# EAGLE design uPy_AudioCodec_00 (EAGLE 6.5.0)
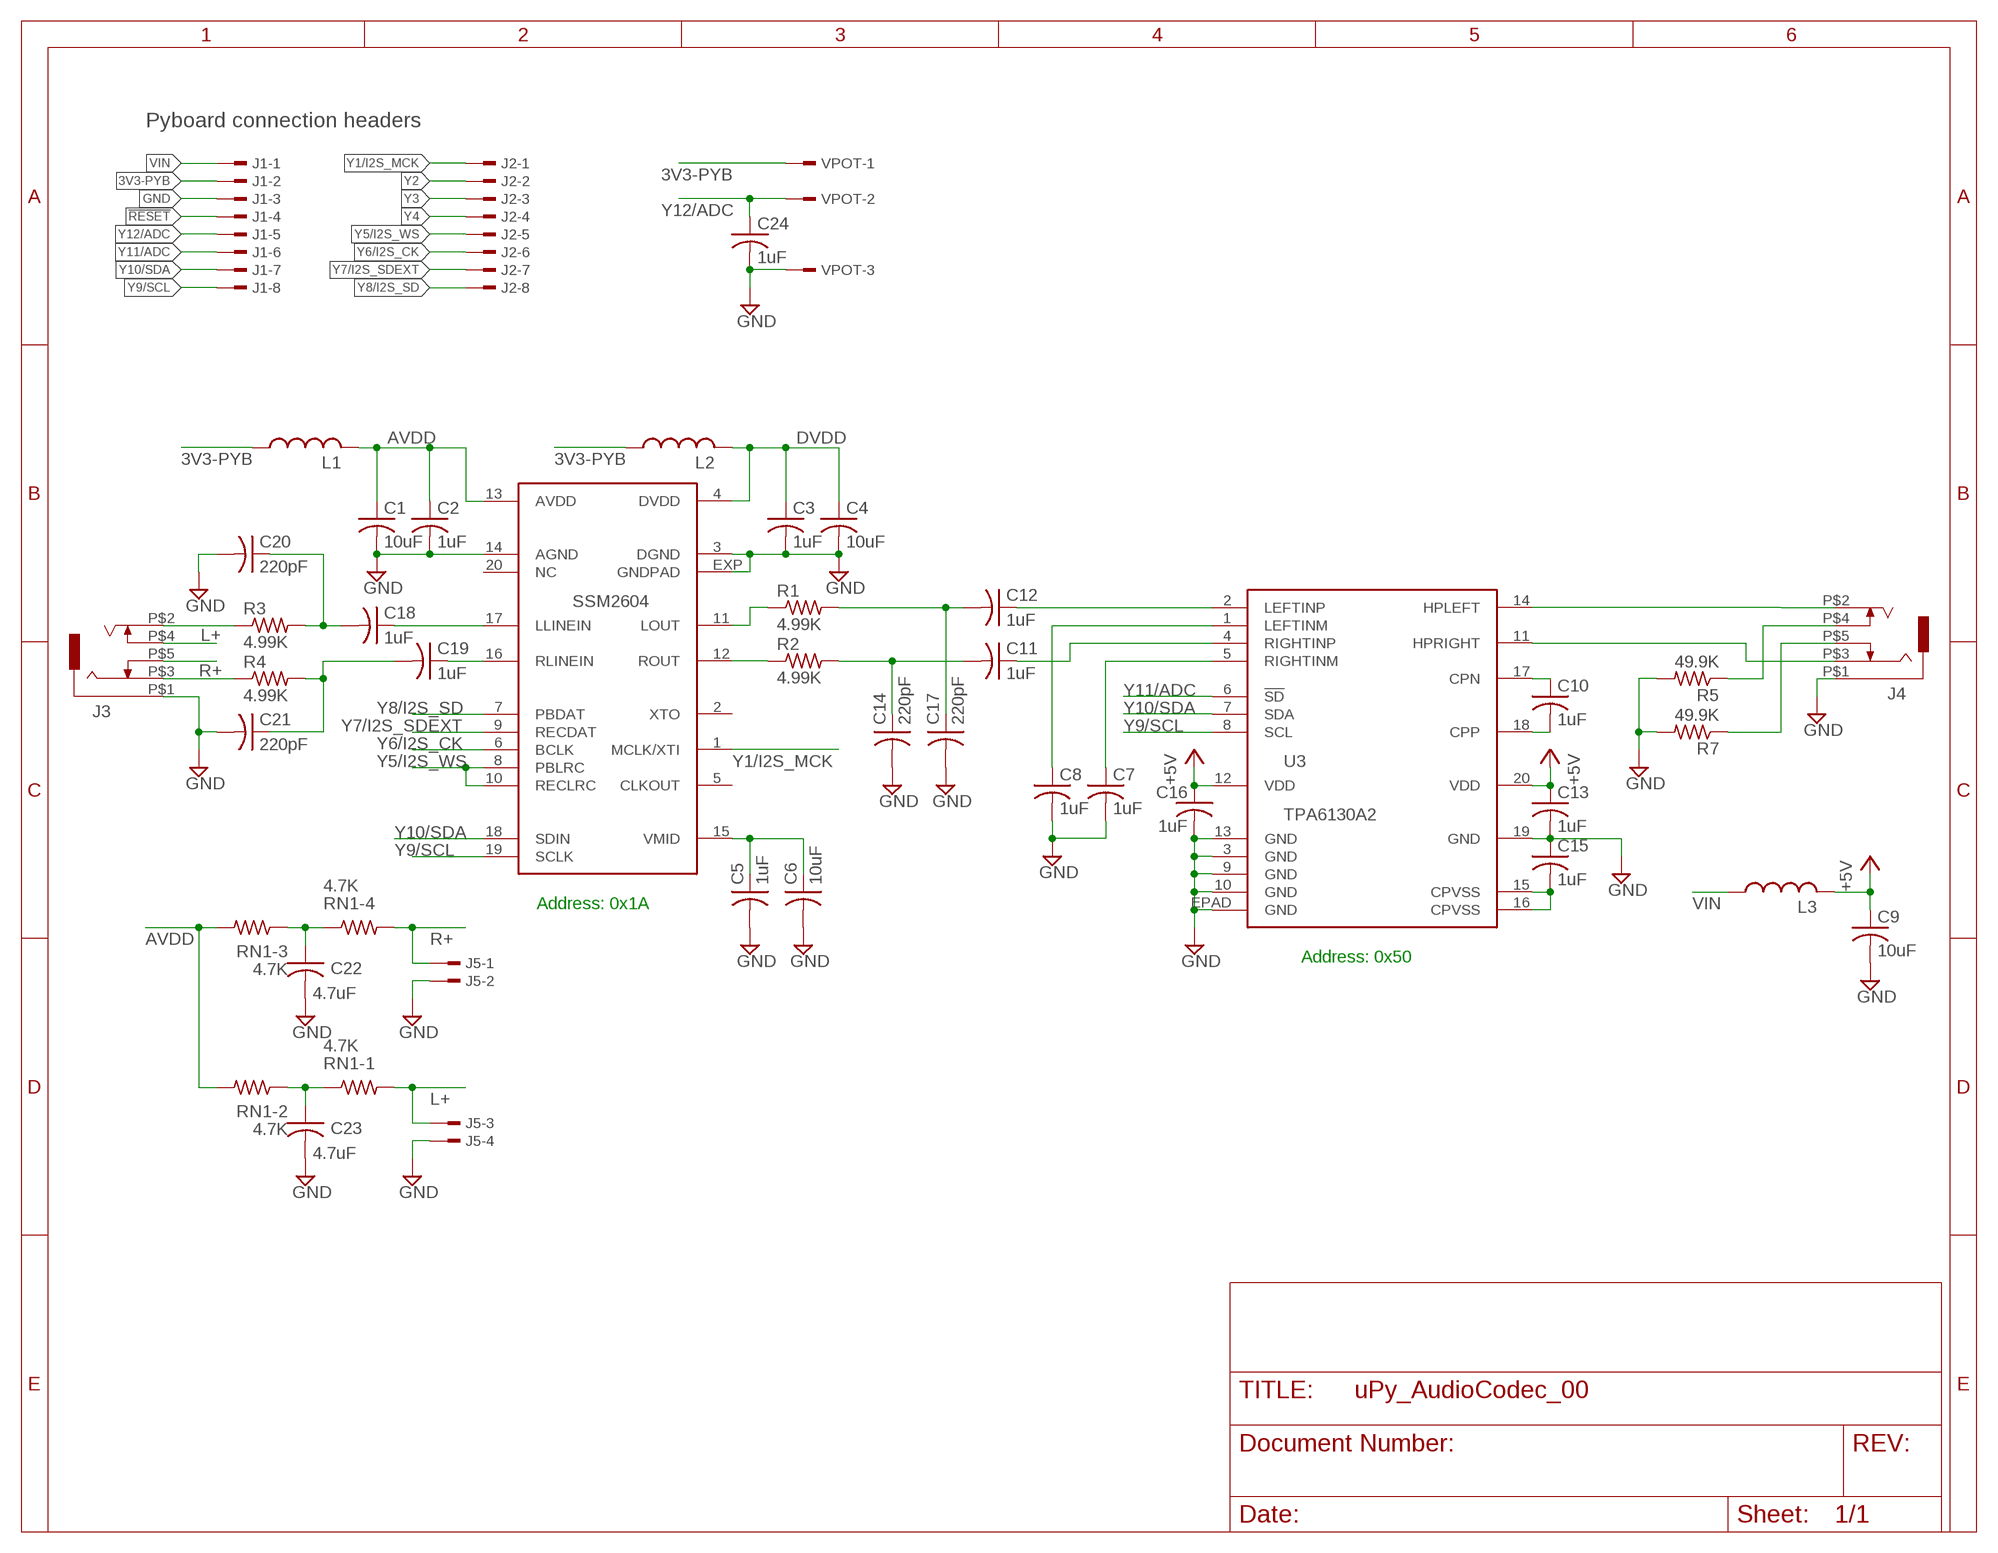
[diagram p0: schematic, sheet 1]

## Parts
C1  10uF  C-USC0603K  [C0603K]
C2  1uF  C-USC0805K  [C0805K]
C3  1uF  C-USC0603K  [C0603K]
C4  10uF  C-USC0805K  [C0805K]
C5  1uF  C-USC0603K  [C0603K]
C6  10uF  C-USC0805K  [C0805K]
C7  1uF  C-USC0603K  [C0603K]
C8  1uF  C-USC0603K  [C0603K]
C9  10uF  C-USC0805K  [C0805K]
C10  1uF  C-USC0603K  [C0603K]
C11  1uF  C-USC0603K  [C0603K]
C12  1uF  C-USC0603K  [C0603K]
C13  1uF  C-USC0603K  [C0603K]
C14  220pF  C-USC0603K  [C0603K]
C15  1uF  C-USC0603K  [C0603K]
C16  1uF  C-USC0603K  [C0603K]
C17  220pF  C-USC0603K  [C0603K]
C18  1uF  C-USC0603K  [C0603K]
C19  1uF  C-USC0603K  [C0603K]
C20  220pF  C-USC0603K  [C0603K]
C21  220pF  C-USC0603K  [C0603K]
C22  4.7uF  C-USC0603K  [C0603K]
C23  4.7uF  C-USC0603K  [C0603K]
C24  1uF  C-USC0603K  [C0603K]
J1  TSW-108-02-S-S-MOD  [TSW-108-02-S-S-MOD]
J2  TSW-108-02-S-S-MOD  [TSW-108-02-S-S-MOD]
J3  CON-JACK-STEREO  [CON-JACK-SJ1-3515-SMT]
J4  CON-JACK-STEREO  [CON-JACK-SJ1-3515-SMT]
J5  TSW-104-02-S-S  [TSW-104-02-S-S-MOD]
L1  L-USL3216C  [L3216C]
L2  L-USL3216C  [L3216C]
L3  L-USL3216C  [L3216C]
R1  4.99K  R-US_R0805  [R0805]
R2  4.99K  R-US_R0805  [R0805]
R3  4.99K  R-US_R0805  [R0805]
R4  4.99K  R-US_R0805  [R0805]
R5  49.9K  R-US_R0805  [R0805]
R7  49.9K  R-US_R0805  [R0805]
RN1  4.7K  4R-ISONET-BB  [CTS-742C083+]
U1  SSM2604-1  [LFCSP20-1]
U3  TPA6130A2  [QFN20-EP]
VPOT  TSW-103-02-S-S  [TSW-103-02-S-S-MOD]

## Nets
3V3-PYB: J1.2 L1.1 L2.1 VPOT.1
!RESET: J1.4
+5V: C9.1 C13.1 C16.1 L3.2 U3.12(VDD) U3.20(VDD)
AVDD: C1.1 C2.1 L1.2 RN1.P$6 RN1.P$7 U1.13(AVDD)
DVDD: C3.1 C4.1 L2.2 U1.4(DVDD)
GND: C1.2 C2.2 C3.2 C4.2 C5.2 C6.2 C7.2 C8.2 C9.2 C13.2 C14.2 C15.1 C16.2 C17.2 C20.2 C21.2 C22.2 C23.2 C24.2 J1.3 J3.P$1(SLEEVE) J4.P$1(SLEEVE) J5.2 J5.4 R5.2 R7.2 U1.3(DGND) U1.14(AGND) U1.EXP(GNDPAD) U3.3(GND) U3.9(GND) U3.10(GND) U3.13(GND) U3.19(GND) U3.EPAD(GND) VPOT.3
L+: J3.P$4(TIP_SW) J5.3 RN1.P$8
N$1: C12.1 U3.2(LEFTINP)
N$2: C18.1 U1.17(LLINEIN)
N$3: C19.1 U1.16(RLINEIN)
N$4: C11.1 U3.4(RIGHTINP)
N$5: J4.P$2(TIP) U3.14(HPLEFT)
N$6: C5.1 C6.1 U1.15(VMID)
N$7: C7.1 U3.5(RIGHTINM)
N$8: C8.1 U3.1(LEFTINM)
N$9: R1.1 U1.11(LOUT)
N$10: C15.2 U3.15(CPVSS) U3.16(CPVSS)
N$11: C10.2 U3.18(CPP)
N$12: J4.P$3(RING) U3.11(HPRIGHT)
N$13: C10.1 U3.17(CPN)
N$14: R2.1 U1.12(ROUT)
N$15: C11.2 C14.1 R2.2
N$16: J4.P$5(RING_SW) R7.1
N$17: J4.P$4(TIP_SW) R5.1
N$18: C12.2 C17.1 R1.2
N$19: J3.P$3(RING) R4.1
N$20: J3.P$2(TIP) R3.1
N$21: C18.2 C20.1 R3.2
N$22: C19.2 C21.1 R4.2
N$23: C22.1 RN1.P$3 RN1.P$4
N$24: C23.1 RN1.P$1 RN1.P$2
R+: J3.P$5(RING_SW) J5.1 RN1.P$5
VIN: J1.1 L3.1
Y1/I2S_MCK: J2.1 U1.1(MCLK/XTI)
Y2: J2.2
Y3: J2.3
Y4: J2.4
Y5/I2S_WS: J2.5 U1.8(PBLRC) U1.10(RECLRC)
Y6/I2S_CK: J2.6 U1.6(BCLK)
Y7/I2S_SDEXT: J2.7 U1.9(RECDAT)
Y8/I2S_SD: J2.8 U1.7(PBDAT)
Y9/SCL: J1.8 U1.19(SCLK) U3.8(SCL)
Y10/SDA: J1.7 U1.18(SDIN) U3.7(SDA)
Y11/ADC: J1.6 U3.6(!SD)
Y12/ADC: C24.1 J1.5 VPOT.2
Unconnected: U1.2(XTO) U1.5(CLKOUT) U1.20(NC)

## Notes on the sheet
- Pyboard connection headers
- SSM2604
- Address: 0x1A
- Address: 0x50

## Library data of the parts
C1-C24 = rcl:C-US: CAPACITOR, American symbol
J1 J2 = pyIMU-03:TSW-108-02-S-S: THROUGH-HOLE .025" SQ POST HEADER Source: Samtec TSW.pdf
J3 J4 = custom:CON-JACK-STEREO
J5 = uPy_AudioCodec_00:TSW-104-02-S-S
L1-L3 = rcl:L-US: INDUCTOR, American symbol
R1-R5 R7 = rcl:R-US_: RESISTOR, American symbol
RN1 = custom:4R-ISONET-B
U1 = custom:SSM2604
U3 = custom:TPA6130A2
VPOT = uPy_AudioCodec_00:TSW-103-02-S-S

## Net classes
0 default: clearance 0.205 mm

## Board
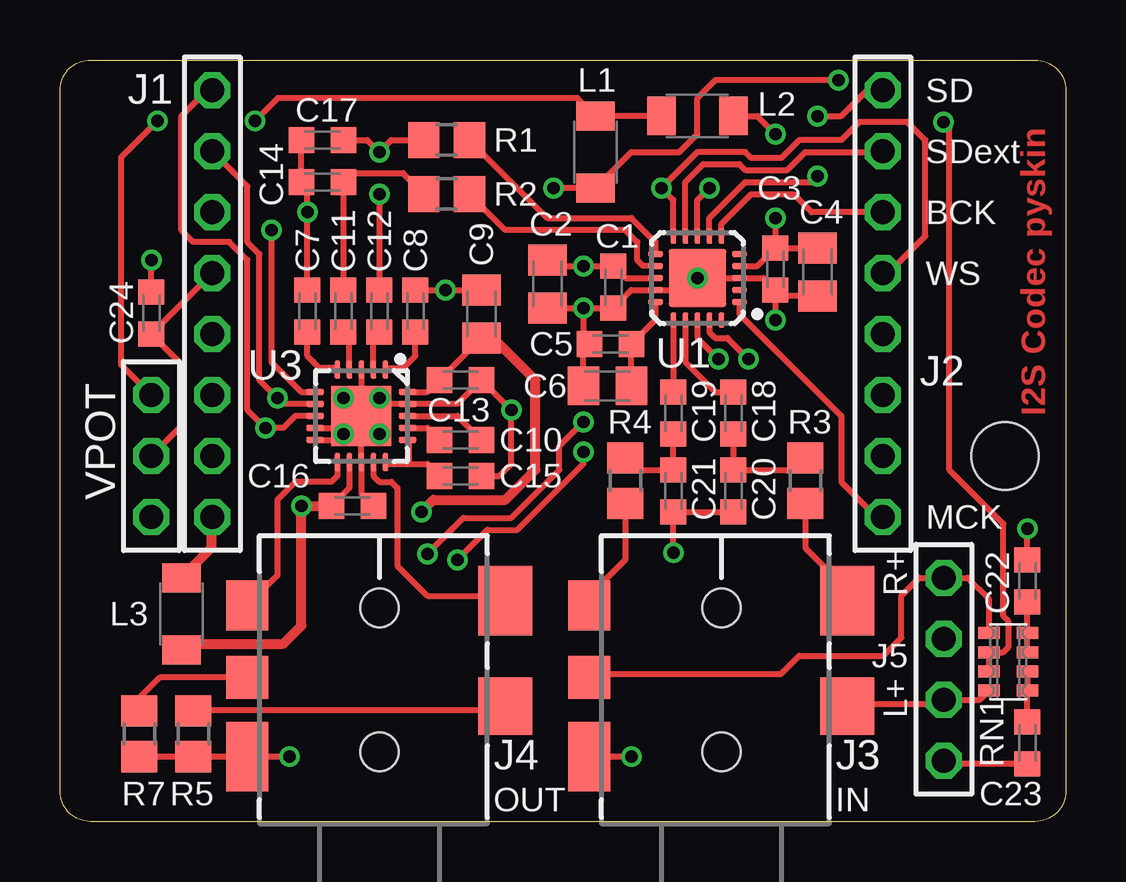
[diagram p1: board, top side]
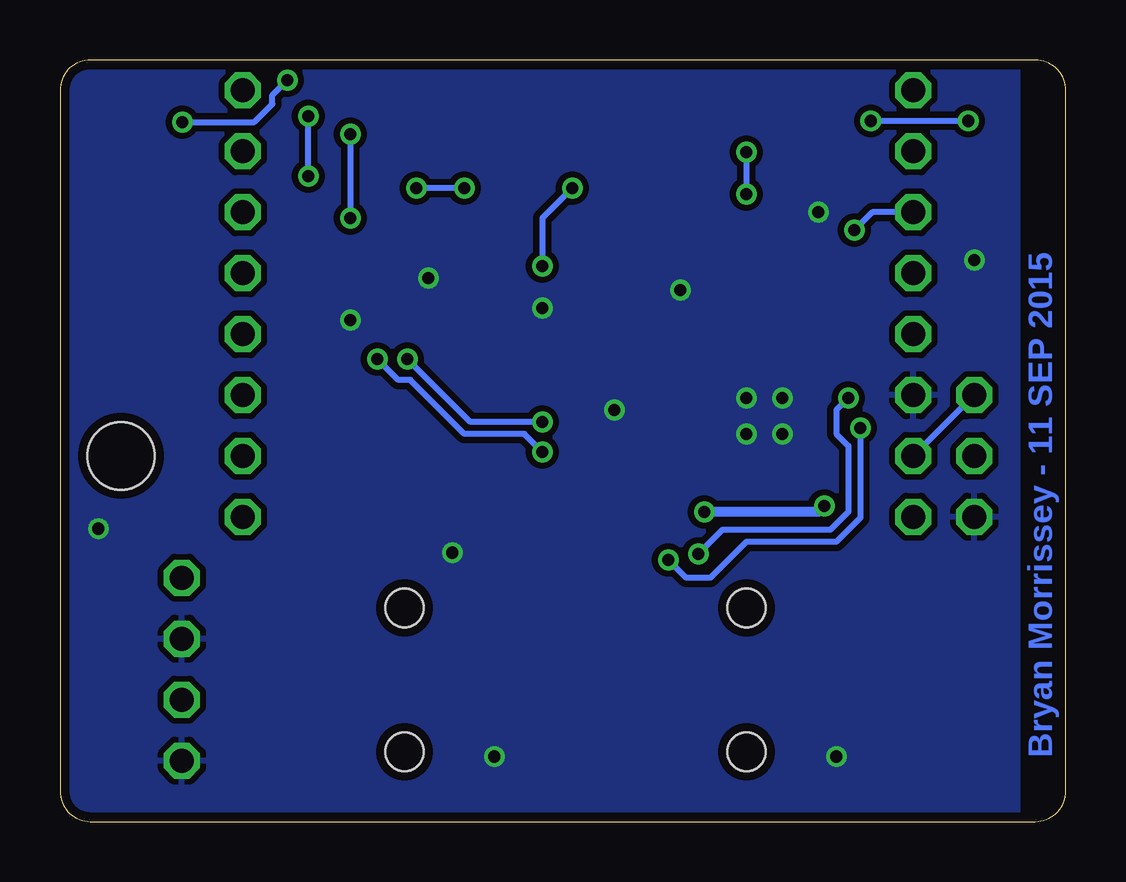
[diagram p2: board, bottom side, seen from below]

Size 41.91 x 31.75 mm. Coordinates in mm from the lower left corner, seen from the top.
Outline: 1.27,31.75 40.64,31.75 arc-90 41.91,30.48 41.91,1.27 arc-90 40.64,0 1.27,0 arc-90 0,1.27 0,30.48 arc-90 1.27,31.75
Copper layers (1*16): Top 0.0356mm / dielectric 1.5011mm / Bottom 0.0356mm
Design rules "LaenPCBOrder *": minimum track width 6mil, minimum drill 13mil, track to track 6mil, track to pad 6mil, pad to pad 6mil, via to via 6mil, smd to smd 6mil, copper to edge 15mil, drill to drill 6mil, minimum pad ring 7mil, minimum via ring 7mil, stop-mask expansion 3mil, vias tented up to drill 0mil, thermal gap 10mil
Holes 2.8 mm at 39.37,15.24

### Footprints (pad centres in the part's own frame; a part is rotated, then mirrored left to right if it is on the bottom)
C0603K = smd 1.05 x 1.08: 1 -0.875,0; 2 0.875,0
C0805K = smd 1.3 x 1.6: 1 -1,0; 2 1,0
TSW-108-02-S-S-MOD = drill 1 pad 1.5 octagon: 1 8.89,0; 2 6.35,0; 3 3.81,0; 4 1.27,0; 5 -1.27,0; 6 -3.81,0; 7 -6.35,0; 8 -8.89,0
CON-JACK-SJ1-3515-SMT = smd 2.9 x 1.75: P$1 -0.2,5.5 | smd 2.9 x 2.25: P$2 6.3,-5.25 | smd 2.1 x 1.75: P$3 6.1,5.5 | smd 2.4 x 2.25: P$4 1.9,-5.25 | smd 1.8 x 1.75: P$5 3.1,5.5 | hole 1.6: 0,0; 6,0
TSW-104-02-S-S-MOD = drill 1 pad 1.5 octagon: 1 3.81,0; 2 1.27,0; 3 -1.27,0; 4 -3.81,0
L3216C = smd 1.2 x 1.6: 1 -1.5,0; 2 1.5,0
R0805 = smd 1.3 x 1.5: 1 -0.95,0; 2 0.95,0
CTS-742C083+ = smd 0.9 x 0.5: P$1 -0.8,1.2; P$2 -0.8,0.4; P$3 -0.8,-0.4; P$4 -0.8,-1.2; P$5 0.8,-1.2; P$6 0.8,-0.4; P$7 0.8,0.4; P$8 0.8,1.2
LFCSP20-1 = smd 0.635 x 0.254: 1 -1.75,1; 2 -1.75,0.5; 3 -1.75,0; 4 -1.75,-0.5; 5 -1.75,-1; 11 1.75,-1; 12 1.75,-0.5; 13 1.75,0; 14 1.75,0.5; 15 1.75,1 | smd 0.254 x 0.635: 6 -1,-1.75; 7 -0.5,-1.75; 8 0,-1.75; 9 0.5,-1.75; 10 1,-1.75; 16 1,1.75; 17 0.5,1.75; 18 0,1.75; 19 -0.5,1.75; 20 -1,1.75 | smd 2.4 x 2.4: EXP 0,0
QFN20-EP = smd 0.75 x 0.25: 1 -1.925,1; 2 -1.925,0.5; 3 -1.925,0; 4 -1.925,-0.5; 5 -1.925,-1; 11 1.925,-1; 12 1.925,-0.5; 13 1.925,0; 14 1.925,0.5; 15 1.925,1 | smd 0.25 x 0.75: 6 -1,-1.925; 7 -0.5,-1.925; 8 0,-1.925; 9 0.5,-1.925; 10 1,-1.925; 16 1,1.925; 17 0.5,1.925; 18 0,1.925; 19 -0.5,1.925; 20 -1,1.925 | smd 2.5 x 2.5: EPAD 0,0
TSW-103-02-S-S-MOD = drill 1 pad 1.5 octagon: 1 2.54,0; 2 0,0; 3 -2.54,0

### Placement (x,y rotation side)
C1  23.06,22.29 270 top
C2  20.31,22.41 270 top
C3  29.81,23.04 270 top
C4  31.56,22.91 270 top
C5  22.93,19.91 180 top
C6  22.81,18.16 180 top
C7  10.31,21.29 90 top
C8  14.81,21.29 90 top
C9  17.56,21.16 90 top
C10  16.68,15.91 0 top
C11  11.81,21.29 90 top
C12  13.31,21.29 90 top
C13  16.68,18.41 0 top
C14  10.94,26.66 180 top
C15  16.68,14.41 180 top
C16  12.19,13.16 0 top
C17  10.94,28.41 180 top
C18  28.06,17.04 270 top
C19  25.56,17.04 270 top
C20  28.06,13.79 270 top
C21  25.56,13.79 270 top
C22  40.31,10.04 90 top
C23  40.31,3.29 270 top
C24  3.81,21.2 90 top
J1  6.35,21.59 270 top
J2  34.29,21.59 270 top
J3  27.56,2.91 90 top
J4  13.31,2.91 90 top
J5  36.83,6.35 90 top
L1  22.31,27.91 270 top
L2  26.56,29.41 0 top
L3  5.06,8.66 270 top
R1  16.11,28.41 180 top
R2  16.11,26.16 180 top
R3  31.06,14.21 90 top
R4  23.56,14.21 90 top
R5  5.56,3.66 270 top
R7  3.31,3.66 270 top
RN1  39.51,6.66 180 top
U1  26.56,22.66 180 top
U3  12.56,16.91 270 top
VPOT  3.81,15.24 90 top

### Tracks (layer width: path | path; a pad name or v marks a point on that pad's centre or on a via)
3V3-PYB  (via drill 0.51)
  Top 0.254: L2.1 L1.1 21.56,30.16 9.08,30.16 v8.13,29.21 | VPOT.1 2.54,19.05 2.54,27.69 v4.06,29.21
  Bottom 0.254: v8.13,29.21 v4.06,29.21 | J1.2 VPOT.1
+5V  (via drill 0.51)
  Top 0.254: U3.12 12.06,13.91 C16.1 | U3.20 15.31,17.91 C13.1 C9.1
  Top 0.406: L3.2 5.31,7.41 9.31,7.41 10.06,8.16 v10.06,13.16 C16.1 | v15.06,12.91 15.56,13.41 18.56,13.41 19.81,14.66 19.81,18.41 18.06,20.16 C9.1
  Bottom 0.406: v10.06,13.16 10.31,12.91 v15.06,12.91
AVDD  (via drill 0.51)
  Top 0.254: C2.1 20.56,23.16 v21.81,23.16 C1.1 23.56,22.66 U1.13 | v20.56,26.41 L1.2 23.81,27.91 25.81,27.91 26.56,28.66 26.56,30.16 27.31,30.91 v32.44,30.91 | RN1.P$7 RN1.P$6 39.31,7.06 39.51,7.26 39.51,8.36 39.31,8.56 39.31,12.41 37.06,14.66 37.06,28.91 v36.81,29.16
  Bottom 0.254: v20.56,26.41 21.81,25.16 v21.81,23.16 | v36.81,29.16 33.81,29.16 33.06,29.91 33.06,30.29 v32.44,30.91
DVDD  (via drill 0.51)
  Top 0.254: U1.4 29.06,23.16 C3.1 | C3.1 C4.1 | L2.2 29.06,29.41 v29.81,28.66 | v29.81,25.16 C3.1
  Bottom 0.254: v29.81,28.66 v29.81,25.16
GND  (via drill 0.51)
  Top 0.254: U3.9 11.56,16.41 v11.81,16.16 | U3.3 U3.EPAD | U3.10 11.56,15.91 v11.81,16.16 | v13.31,17.66 13.56,17.41 U3.19 16.56,17.41 C13.2 v18.81,17.16 18.81,14.91 18.31,14.41 C15.1 | U3.EPAD U3.13 12.56,13.66 C16.2 | C7.2 v10.31,25.41 10.31,26.41 C14.2 C17.2 | C8.2 v16.06,22.16 C9.2 | C3.2 29.31,22.66 U1.3 U1.EXP 26.06,22.16 U1.14 23.81,22.16 C1.2 v21.81,21.41 | R7.2 R5.2 J4.P$1 v9.56,2.71 | C3.2 v29.81,20.91 | C4.2 30.06,21.91 C3.2 | C2.2 v21.81,21.41 | v21.81,21.41 21.81,20.16 C5.2 21.81,19.66 C6.2 | J3.P$1 v23.81,2.71 | v25.56,11.21 C21.2 C20.2 | U3.EPAD v11.81,16.16 | C22.2 v40.31,12.21 | C23.2 36.96,2.41 J5.4 | C24.2 v3.81,23.41
  other vias: 11.81,17.66 13.31,16.16 26.56,22.66
  pour Bottom (isolate 0.254): 2.03,0.25 41.66,0.25 41.66,31.5 2.03,31.5
L+
  Top 0.254: RN1.P$8 38.33,5.08 J5.3 36.66,4.91 32.91,4.91 J3.P$4
N$1
  Top 0.254: U3.2 13.06,20.16 C12.1
N$2
  Top 0.254: U1.17 26.06,19.16 27.31,17.91 C18.1
N$3
  Top 0.254: U1.16 C19.1
N$4
  Top 0.254: U3.4 12.06,20.16 C11.1
N$5
  Top 0.254: U3.14 13.06,14.41 13.31,14.16 13.81,14.16 14.06,13.91 14.06,10.66 15.31,9.41 18.31,9.41 18.51,9.21 J4.P$2
N$6
  Top 0.254: U1.15 24.81,20.91 C5.1 C6.1
N$7
  Top 0.254: C7.1 10.31,19.41 10.56,19.16 10.81,18.91 11.56,18.91 U3.5
N$8
  Top 0.254: C8.1 14.81,19.41 14.31,18.91 13.56,18.91 U3.1
N$9
  Top 0.254: R1.1 20.31,25.16 23.81,25.16 24.81,24.16 U1.11
N$10
  Top 0.254: U3.15 13.56,14.91 14.56,14.91 | 14.56,14.91 14.56,15.91 U3.16 | 14.56,14.91 15.31,14.91 C15.2
N$11
  Top 0.254: U3.18 16.56,16.91 C10.2
N$12
  Top 0.254: J4.P$3 9.06,10.26 9.06,13.41 9.81,14.16 11.31,14.16 11.56,14.41 U3.11
N$13
  Top 0.254: U3.17 15.31,16.41 C10.1
N$14
  Top 0.254: U1.12 24.31,23.16 24.06,23.41 24.06,24.16 23.56,24.66 18.56,24.66 R2.1
N$15
  Top 0.254: C11.2 C14.1 12.19,27.04 14.29,27.04 R2.2
N$16
  Top 0.254: R7.1 3.31,5.16 4.16,6.01 J4.P$5
N$17
  Top 0.254: R5.1 5.56,4.66 18.41,4.66 J4.P$4
N$18  (via drill 0.51)
  Top 0.254: C17.1 12.81,28.41 v13.31,27.91 13.81,28.41 R1.2 | v13.31,26.16 C12.2
  Bottom 0.254: v13.31,27.91 v13.31,26.16
N$19
  Top 0.254: R4.1 23.56,10.91 22.06,9.41 J3.P$3
N$20
  Top 0.254: R3.1 31.06,11.41 32.81,9.66 J3.P$2
N$21
  Top 0.254: C18.2 C20.1 30.56,14.66 R3.2
N$22
  Top 0.254: R4.2 24.06,14.66 C21.1 C19.2
N$23
  Top 0.254: C22.1 RN1.P$4 RN1.P$3
N$24
  Top 0.254: C23.1 RN1.P$1 RN1.P$2
R+
  Top 0.254: RN1.P$5 38.71,9.26 37.81,10.16 J5.1 35.81,10.16 35.06,9.41 35.06,7.66 34.31,6.91 30.81,6.91 30.06,6.16 22.06,6.16 J3.P$5
VIN
  Top 0.254: J1.1 6.31,12.66
  Top 0.406: 6.31,12.66 6.31,11.41 L3.1
Y1/I2S_MCK
  Top 0.254: U1.1 28.31,21.16 32.56,16.91 32.56,14.16 34.02,12.7 J2.1
Y5/I2S_WS  (via drill 0.51)
  Top 0.254: U1.8 26.56,25.91 v27.06,26.41 | U1.10 25.56,25.91 v25.06,26.41 26.56,27.91 28.56,27.91 28.81,27.66 30.06,27.66 30.81,28.41 32.56,28.41 33.31,29.16 35.31,29.16 36.06,28.41 36.06,24.41 34.51,22.86 J2.5
  Bottom 0.254: v25.06,26.41 v27.06,26.41
Y6/I2S_CK
  Top 0.254: U1.6 27.56,24.91 27.81,25.16 28.8,26.15 30.57,26.15 31.32,25.4 J2.6
Y7/I2S_SDEXT
  Top 0.254: U1.9 26.06,26.66 26.81,27.41 28.31,27.41 28.56,27.16 30.31,27.16 31.06,27.91 34.26,27.91 J2.7
Y8/I2S_SD  (via drill 0.51)
  Top 0.254: U1.7 27.06,25.16 28.56,26.66 31.31,26.66 v31.56,26.91 | v31.56,29.41 32.56,29.41 33.63,30.48 J2.8
  Bottom 0.254: v31.56,26.91 v31.56,29.41
Y9/SCL  (via drill 0.51)
  Top 0.254: J1.8 6.13,30.48 5.06,29.41 5.06,24.66 5.56,24.16 7.06,24.16 7.81,23.41 7.81,17.16 v8.56,16.41 9.31,16.41 9.81,16.91 U3.8 | U1.19 27.06,20.41 27.31,20.16 27.81,20.16 v28.68,19.29 | v16.56,10.91 17.81,12.16 19.06,12.16 21.81,14.91 v21.81,15.41
  Bottom 0.254: v8.56,16.41 8.56,12.66 9.56,11.66 13.31,11.66 14.81,10.16 15.81,10.16 v16.56,10.91 | v21.81,15.41 22.56,16.16 25.06,16.16 27.31,18.41 27.81,18.41 v28.68,19.29
Y10/SDA  (via drill 0.51)
  Top 0.254: J1.7 7.81,26.48 7.81,24.16 8.31,23.66 8.31,18.41 v9.06,17.66 9.31,17.41 U3.7 | U1.18 26.56,20.16 v27.43,19.29 | v15.31,11.16 16.81,12.66 18.81,12.66 20.81,14.66 20.81,15.66 v21.81,16.66
  Bottom 0.254: v9.06,17.66 9.56,17.16 9.56,16.16 9.06,15.66 9.06,12.91 9.81,12.16 14.31,12.16 v15.31,11.16 | v21.81,16.66 24.81,16.66 v27.43,19.29
Y11/ADC  (via drill 0.51)
  Top 0.254: v8.81,24.66 8.81,19.16 10.06,17.91 U3.6
  Bottom 0.254: J1.6 8.07,25.4 v8.81,24.66
Y12/ADC
  Top 0.254: J1.5 C24.1 5.08,19.05 5.08,16.51 VPOT.2

### Text on the board
Top: I2S Codec pyskin
Bottom: Bryan Morrissey - 11 SEP 2015
tPlace: SD | SDext | BCK | WS | MCK | R+ | L+ | OUT | IN